# EAGLE schematic TurntableStrobe (EAGLE 7.1.0)
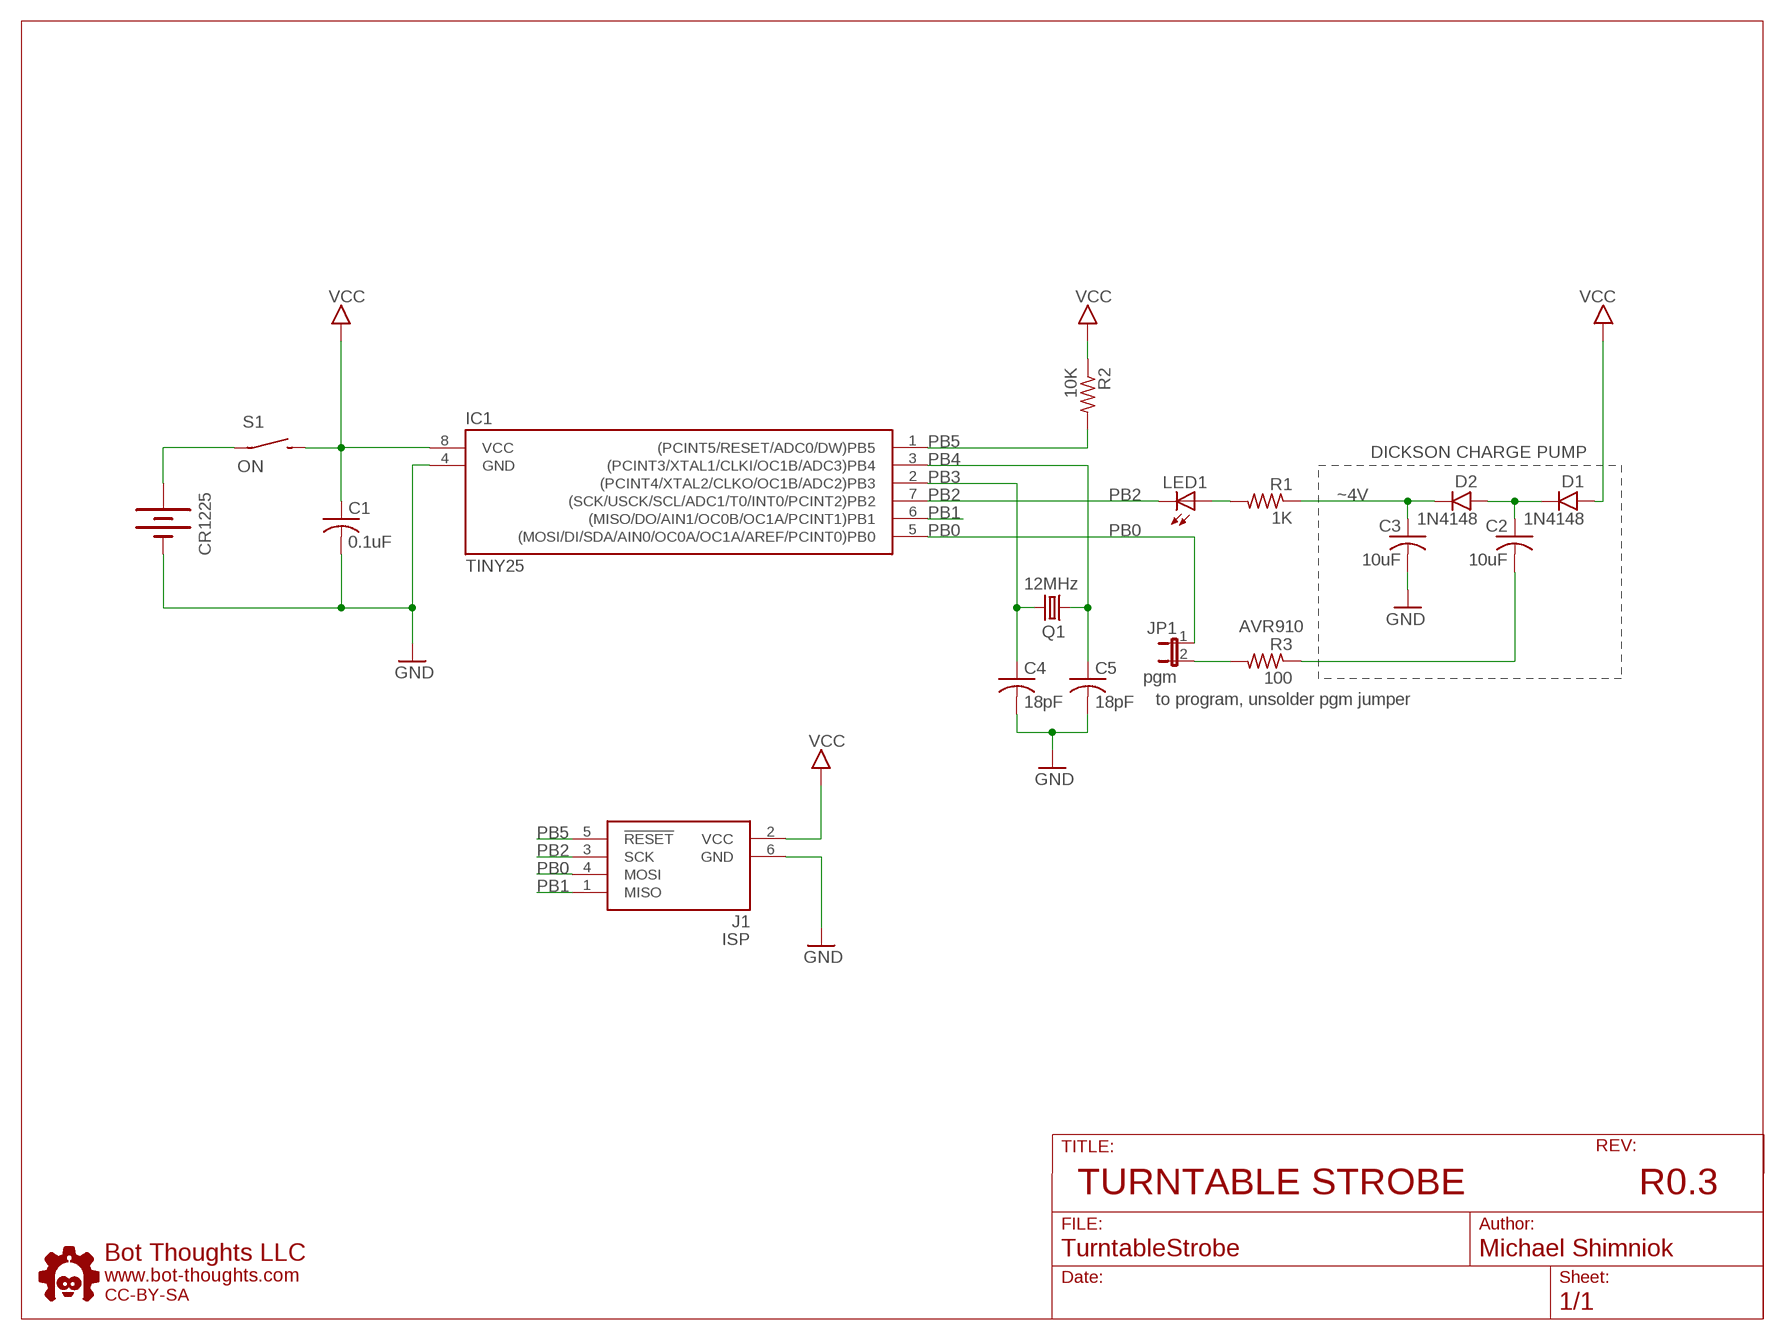
[diagram p0: schematic, sheet 1]

## Parts
C1  0.1uF  C-USC0603  [C0603]
C2  10uF  C-USC0603  [C0603]
C3  10uF  C-USC0603  [C0603]
C4  18pF  C-USC0603  [C0603]
C5  18pF  C-USC0603  [C0603]
CR1225  BATTERY12PTH  [BATTCON_12MM_PTH]
D1  1N4148  DIODE_SOD323  [SOD-323]
D2  1N4148  DIODE_SOD323  [SOD-323]
IC1  TINY25  TINY25/45/85-20SSU  [SOIC8N]
J1  ISP  AVRISP6_TP  [2X3_TP]
JP1  pgm  JUMPER-2SMD-NO  [SJ_2S-NO]
LED1  LED5MMRA  [LED5MMRA]
Q1  12MHz  CRYSTALNDK5X3  [NDK_2PAD_5X3]
R1  1K  R-US_R0603  [R0603]
R2  10K  R-US_R0603  [R0603]
R3  100  R-US_R0603  [R0603]
S1  ON  SPST_TAC_RECT1  [6MMTACTILE_RECT]
U$5  BTLOGO-LOGO-MD  [BTLOGOM]

## Nets
GND: C1.2 C3.2 C4.2 C5.2 CR1225.GND(-) IC1.4(GND) J1.6(GND)
N$1: JP1.2 R3.2
N$2: C2.1 D1.C D2.A
N$3: LED1.A R1.2
N$4: C2.2 R3.1
PB0: IC1.5((MOSI/DI/SDA/AIN0/OC0A/OC1A/AREF/PCINT0)PB0) J1.4(MOSI) JP1.1
PB1: IC1.6((MISO/DO/AIN1/OC0B/OC1A/PCINT1)PB1) J1.1(MISO)
PB2: IC1.7((SCK/USCK/SCL/ADC1/T0/INT0/PCINT2)PB2) J1.3(SCK) LED1.C
PB3: C4.1 IC1.2((PCINT4/XTAL2/CLKO/OC1B/ADC2)PB3) Q1.P$2
PB4: C5.1 IC1.3((PCINT3/XTAL1/CLKI/OC1B/ADC3)PB4) Q1.P$1
PB5: IC1.1((PCINT5/RESET/ADC0/DW)PB5) J1.5(!RESET) R2.2
VBAT: CR1225.VCC@1(+) S1.P$1(P)
VCC: C1.1 D1.A IC1.8(VCC) J1.2(VCC) R2.1 S1.P$2(S)
VHI: C3.1 D2.C R1.1

## Notes on the sheet
- DICKSON CHARGE PUMP
- ~4V
- AVR910
- to program, unsolder pgm jumper
- TURNTABLE STROBE | R0.3

## Library data of the parts
C1-C5 = rcl:C-US: CAPACITOR, American symbol
CR1225 = SparkFun:BATTERY: Battery Holders Various common sizes : AA, AAA, 20mm coin cell and 12mm coin cell.
D1 D2 = bt_diode:DIODE: Diode Collection of generic diodes in various packages
IC1 = bt_avr:TINY25/45/85: Atmel AVR ATiny25,45,85 8-bit Microcontroller
J1 = bt_avr:AVRISP6: 6-pin dual-row connector for Atmel AVRISP programmer interface
JP1 = SparkFun-Retired:JUMPER-2: Jumper Basic 0.1" spaced jumper. Use with breakaway headers.
LED1 = bt_opto:LED: LED Various packages
Q1 = bt_crystal:CRYSTAL: CRYSTAL
R1-R3 = rcl:R-US_: RESISTOR, American symbol
S1 = bt_electromech:SPST: SPST SWITCH
U$5 = bt:BTLOGO: Bot Thoughts Logo